# EAGLE schematic EggMill (EAGLE 7.6.0)
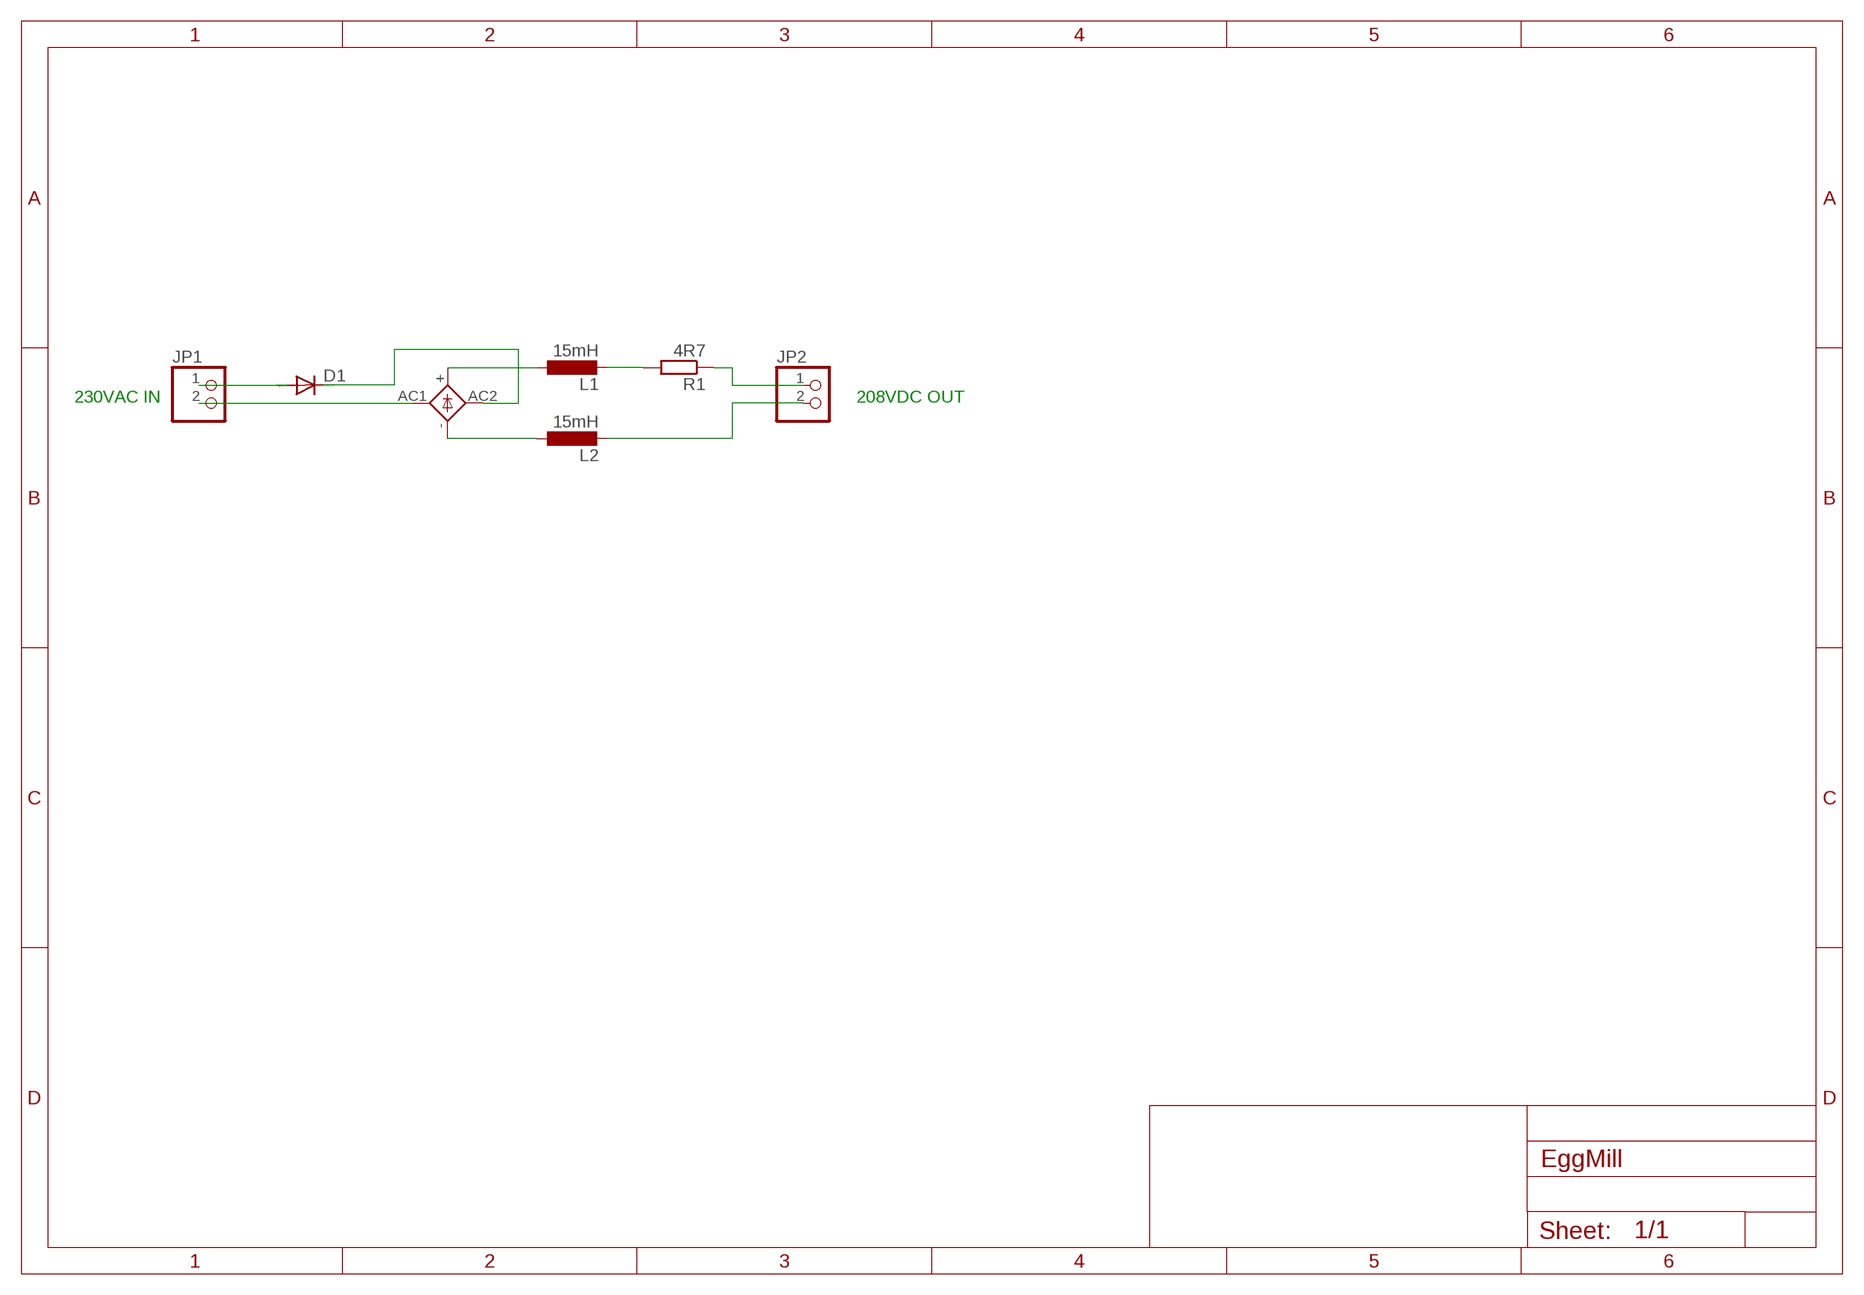
[diagram p0: schematic, sheet 1]

## Parts
B1  DSI32  [DSI32]
D1  BY505  [SOD61A]
JP1  PINHD-1X2  [1X02]
JP2  PINHD-1X2  [1X02]
L1  15mH  L-EULAL03KB  [LAL03KH]
L2  15mH  L-EULAL03KB  [LAL03KH]
R1  4R7  R-EU_0922V  [0922V]

## Nets
N$1: D1.A JP1.1
N$2: B1.AC1 JP1.2
N$3: B1.+ L1.1
N$4: L1.2 R1.2
N$5: JP2.1 R1.1
N$6: JP2.2 L2.2
N$7: B1.- L2.1
N$8: B1.AC2 D1.C

## Notes on the sheet
- 230VAC IN | 208VDC OUT

## Library data of the parts
B1 = rectifier:DSI32: RECTIFIER 3.2 A
D1 = diode:BY505: DIODE high-voltage soft recovery rectifier
JP1 JP2 = pinhead:PINHD-1X2: PIN HEADER
L1 L2 = rcl:L-EU: INDUCTOR, European symbol
R1 = rcl:R-EU_: RESISTOR, European symbol